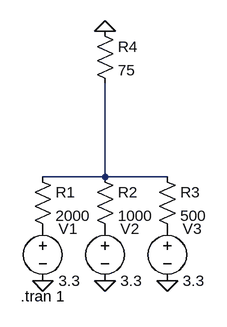
[diagram p0: schematic vga conn.asc]
vga conn.asc, the LTspice schematic file:
Version 4
SHEET 1 880 680
WIRE 208 224 208 80
WIRE 208 224 112 224
WIRE 304 224 208 224
FLAG 112 384 0
FLAG 208 384 0
FLAG 304 384 0
FLAG 208 0 0
SYMBOL voltage 112 288 R0
WINDOW 123 0 0 Left 0
WINDOW 39 0 0 Left 0
SYMATTR InstName V1
SYMATTR Value 3.3
SYMBOL voltage 208 288 R0
WINDOW 123 0 0 Left 0
WINDOW 39 0 0 Left 0
SYMATTR InstName V2
SYMATTR Value 3.3
SYMBOL voltage 304 288 R0
WINDOW 123 0 0 Left 0
WINDOW 39 0 0 Left 0
SYMATTR InstName V3
SYMATTR Value 3.3
SYMBOL res 96 208 R0
SYMATTR InstName R1
SYMATTR Value 2000
SYMBOL res 192 208 R0
SYMATTR InstName R2
SYMATTR Value 1000
SYMBOL res 288 208 R0
SYMATTR InstName R3
SYMATTR Value 500
SYMBOL res 192 -16 R0
SYMATTR InstName R4
SYMATTR Value 75
TEXT 78 408 Left 2 !.tran 1

The netlist it stands for:
* vga conn.asc
V1 P001 0 3.3
V2 P002 0 3.3
V3 P003 0 3.3
R1 N001 P001 2000
R2 N001 P002 1000
R3 N001 P003 500
R4 0 N001 75
.tran 1
.backanno
.end